# EAGLE design aansluitschema (EAGLE 9.6.2)
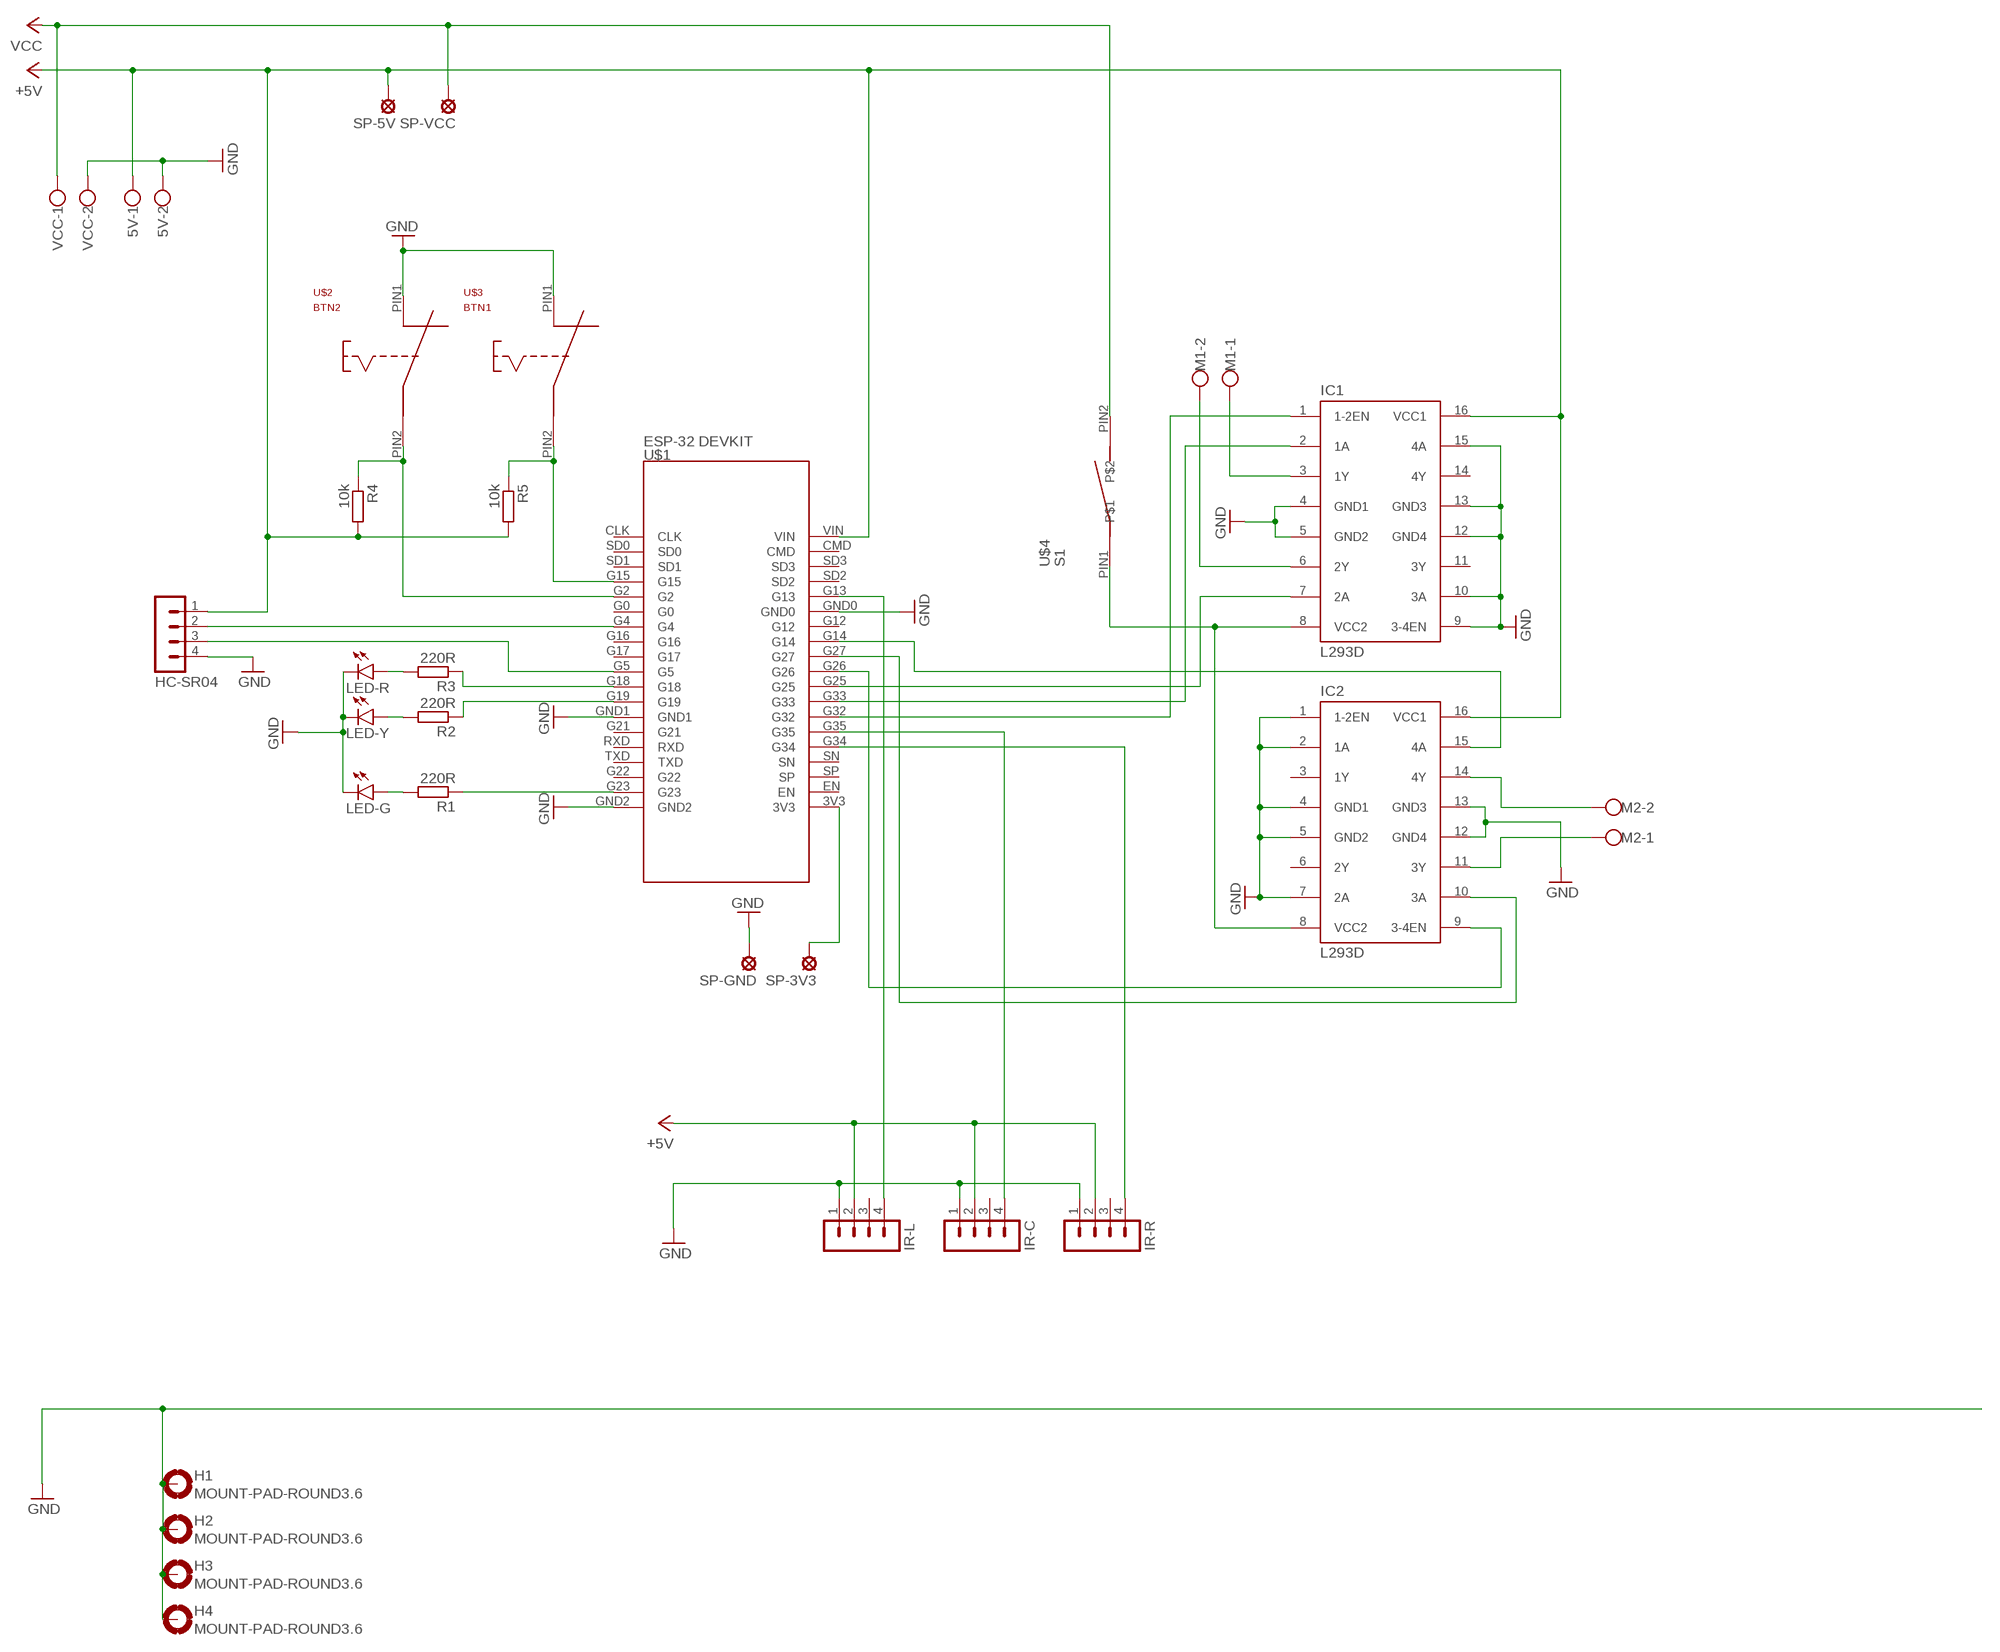
[diagram p0: schematic, sheet 1]

## Parts
5V  W237-102  [W237-102]
H1  MOUNT-PAD-ROUND3.6  [3,6-PAD]
H2  MOUNT-PAD-ROUND3.6  [3,6-PAD]
H3  MOUNT-PAD-ROUND3.6  [3,6-PAD]
H4  MOUNT-PAD-ROUND3.6  [3,6-PAD]
HC-SR04  MA04-1  [MA04-1]
IC1  L293D  L293E  [DIL16]
IC2  L293D  L293E  [DIL16]
IR-C  MA04-1  [MA04-1]
IR-L  MA04-1  [MA04-1]
IR-R  MA04-1  [MA04-1]
LED-G  LED5MM  [LED5MM]
LED-R  LED5MM  [LED5MM]
LED-Y  LED5MM  [LED5MM]
M1  W237-102  [W237-102]
M2  W237-102  [W237-102]
R1  220R  R-EU_0207/10  [0207/10]
R2  220R  R-EU_0207/10  [0207/10]
R3  220R  R-EU_0207/10  [0207/10]
R4  10k  R-EU_0207/10  [0207/10]
R5  10k  R-EU_0207/10  [0207/10]
SP-3V3  LSP10  [LSP10]
SP-5V  LSP10  [LSP10]
SP-GND  LSP10  [LSP10]
SP-VCC  LSP10  [LSP10]
U$1  ESP-32 DEVKIT  ESP-32_DEVKIT  [ESP-32_DEVKIT]
U$2  BTN2  PUSHBUTTON  [PUSHBUTTON]
U$3  BTN1  PUSHBUTTON  [PUSHBUTTON]
U$4  S1  SWITCH  [SWITCH]
VCC  W237-102  [W237-102]

## Nets
+5V: 5V.1 HC-SR04.1 IC1.16(VCC1) IC2.16(VCC1) IR-C.2 IR-L.2 IR-R.2 R4.2 R5.2 SP-5V.MP U$1.VIN
GND: 5V.2 H1.B3,6(MOUNT) H2.B3,6(MOUNT) H3.B3,6(MOUNT) H4.B3,6(MOUNT) HC-SR04.4 IC1.4(GND1) IC1.5(GND2) IC1.9(3-4EN) IC1.10(3A) IC1.12(GND4) IC1.13(GND3) IC1.15(4A) IC2.1(1-2EN) IC2.2(1A) IC2.4(GND1) IC2.5(GND2) IC2.7(2A) IC2.12(GND4) IC2.13(GND3) IR-C.1 IR-L.1 IR-R.1 LED-G.K(C) LED-R.K(C) LED-Y.K(C) SP-GND.MP U$1.GND0 U$1.GND1 U$1.GND2 U$2.PIN1 U$3.PIN1 VCC.2
N$1: IC1.8(VCC2) IC2.8(VCC2) U$4.PIN1
N$2: LED-G.A R1.2
N$3: LED-Y.A R2.2
N$4: LED-R.A R3.2
N$5: R2.1 U$1.G19
N$6: R3.1 U$1.G18
N$7: R1.1 U$1.G23
N$8: IR-R.4 U$1.G34
N$9: IR-C.4 U$1.G35
N$10: IR-L.4 U$1.G13
N$11: HC-SR04.3 U$1.G5
N$12: HC-SR04.2 U$1.G4
N$13: R4.1 U$1.G2 U$2.PIN2
N$14: R5.1 U$1.G15 U$3.PIN2
N$15: IC1.3(1Y) M1.1
N$16: IC1.6(2Y) M1.2
N$17: IC2.11(3Y) M2.1
N$18: IC2.14(4Y) M2.2
N$19: IC1.1(1-2EN) U$1.G32
N$20: IC1.2(1A) U$1.G33
N$21: IC1.7(2A) U$1.G25
N$22: IC2.9(3-4EN) U$1.G26
N$23: IC2.10(3A) U$1.G27
N$24: IC2.15(4A) U$1.G14
N$25: SP-3V3.MP U$1.3V3
VCC: SP-VCC.MP U$4.PIN2 VCC.1
Unconnected: IC1.11(3Y) IC1.14(4Y) IC2.3(1Y) IC2.6(2Y) IR-C.3 IR-L.3 IR-R.3 U$1.CLK U$1.CMD U$1.EN U$1.G0 U$1.G12 U$1.G16 U$1.G17 U$1.G21 U$1.G22 U$1.RXD U$1.SD0 U$1.SD1 U$1.SD2 U$1.SD3 U$1.SN U$1.SP U$1.TXD

## Library data of the parts
5V M1 M2 VCC = con-wago-500:W237-102: WAGO SCREW CLAMP; MPN: 237-102; OC_FARNELL: unknown; OC_NEWARK: 70K9898
H1-H4 = holes:MOUNT-PAD-ROUND: MOUNTING PAD, round
HC-SR04 IR-C IR-L IR-R = con-lstb:MA04-1: PIN HEADER; OC_FARNELL: unknown; OC_NEWARK: unknown
IC1 IC2 = texas:L293E: TI DEVICE; MF: Arrow Electronics; MPN: L293E; OC_FARNELL: 1467711; OC_NEWARK: 89K0732
LED-G LED-R LED-Y = led:LED: LED OSRAM: - CHIPLED LG R971, LG N971, LY N971, LG Q971, LY Q971, LO R971, LY R971 LH N974, LH R974 LS Q976, LO Q976, LY Q976 LO Q996 - Hyper CHIPLED LW Q18S LB Q993, LB Q99A, LB R99A - SideLED LS A670, LO A670, LY A670, LG A670, LP A670 LB A673, LV A673, LT A673, LW A673 LH A674 LY A675 LS A676, LA A676, LO A676, LY A676, LW A676 LS A679, LY A679, LG A679 - Hyper Micro SIDELED® LS Y876, LA Y876, LO Y876, LY Y876 LT Y87S - SmartLED LW L88C, LW L88S LB L89C, LB L89S, LG L890 LS L89K, LO L89K, LY L89K LS L896, LA L896, LO L896, LY L896 - TOPLED LS T670, LO T670, LY T670, LG T670, LP T670 LSG T670, LSP T670, LSY T670, LOP T670, LYG T670 LG T671, LOG T671, LSG T671 LB T673, LV T673, LT T673, LW T673 LH T674 LS T676, LA T676, LO T676, LY T676, LB T676, LH T676, LSB T676, LW T676 LB T67C, LV T67C, LT T67C, LS T67K, LO T67K, LY T67K, LW E67C LS E67B, LA E67B, LO E67B, LY E67B, LB E67C, LV E67C, LT E67C LW T67C LS T679, LY T679, LG T679 LS T770, LO T770, LY T770, LG T770, LP T770 LB T773, LV T773, LT T773, LW T773 LH T774 LS E675, LA E675, LY E675, LS T675 LS T776, LA T776, LO T776, LY T776, LB T776 LHGB T686 LT T68C, LB T68C - Hyper Mini TOPLED® LB M676 - Mini TOPLED Santana® LG M470 LS M47K, LO M47K, LY M47K Source: http://www.osram.convergy.de LUXEON: - LUMILED® LXK2-PW12-R00, LXK2-PW12-S00, LXK2-PW14-U00, LXK2-PW14-V00 LXK2-PM12-R00, LXK2-PM12-S00, LXK2-PM14-U00 LXK2-PE12-Q00, LXK2-PE12-R00, LXK2-PE12-S00, LXK2-PE14-T00, LXK2-PE14-U00 LXK2-PB12-K00, LXK2-PB12-L00, LXK2-PB12-M00, LXK2-PB14-N00, LXK2-PB14-P00, LXK2-PB14-Q00 LXK2-PR12-L00, LXK2-PR12-M00, LXK2-PR14-Q00, LXK2-PR14-R00 LXK2-PD12-Q00, LXK2-PD12-R00, LXK2-PD12-S00 LXK2-PH12-R00, LXK2-PH12-S00 LXK2-PL12-P00, LXK2-PL12-Q00, LXK2-PL12-R00 Source: www.luxeon.com KINGBRIGHT: KA-3528ASYC Source: www.kingbright.com
R1-R5 = rcl:R-EU_: RESISTOR, European symbol; SPICEPREFIX: R
SP-3V3 SP-5V SP-GND SP-VCC = solpad:LSP10: SOLDER PAD drill 1.0 mm, distributor Buerklin, 12H555
U$1 = IoT_project:ESP-32_DEVKIT
U$2 U$3 = IoT_project:PUSHBUTTON
U$4 = IoT_project:SWITCH

## Board
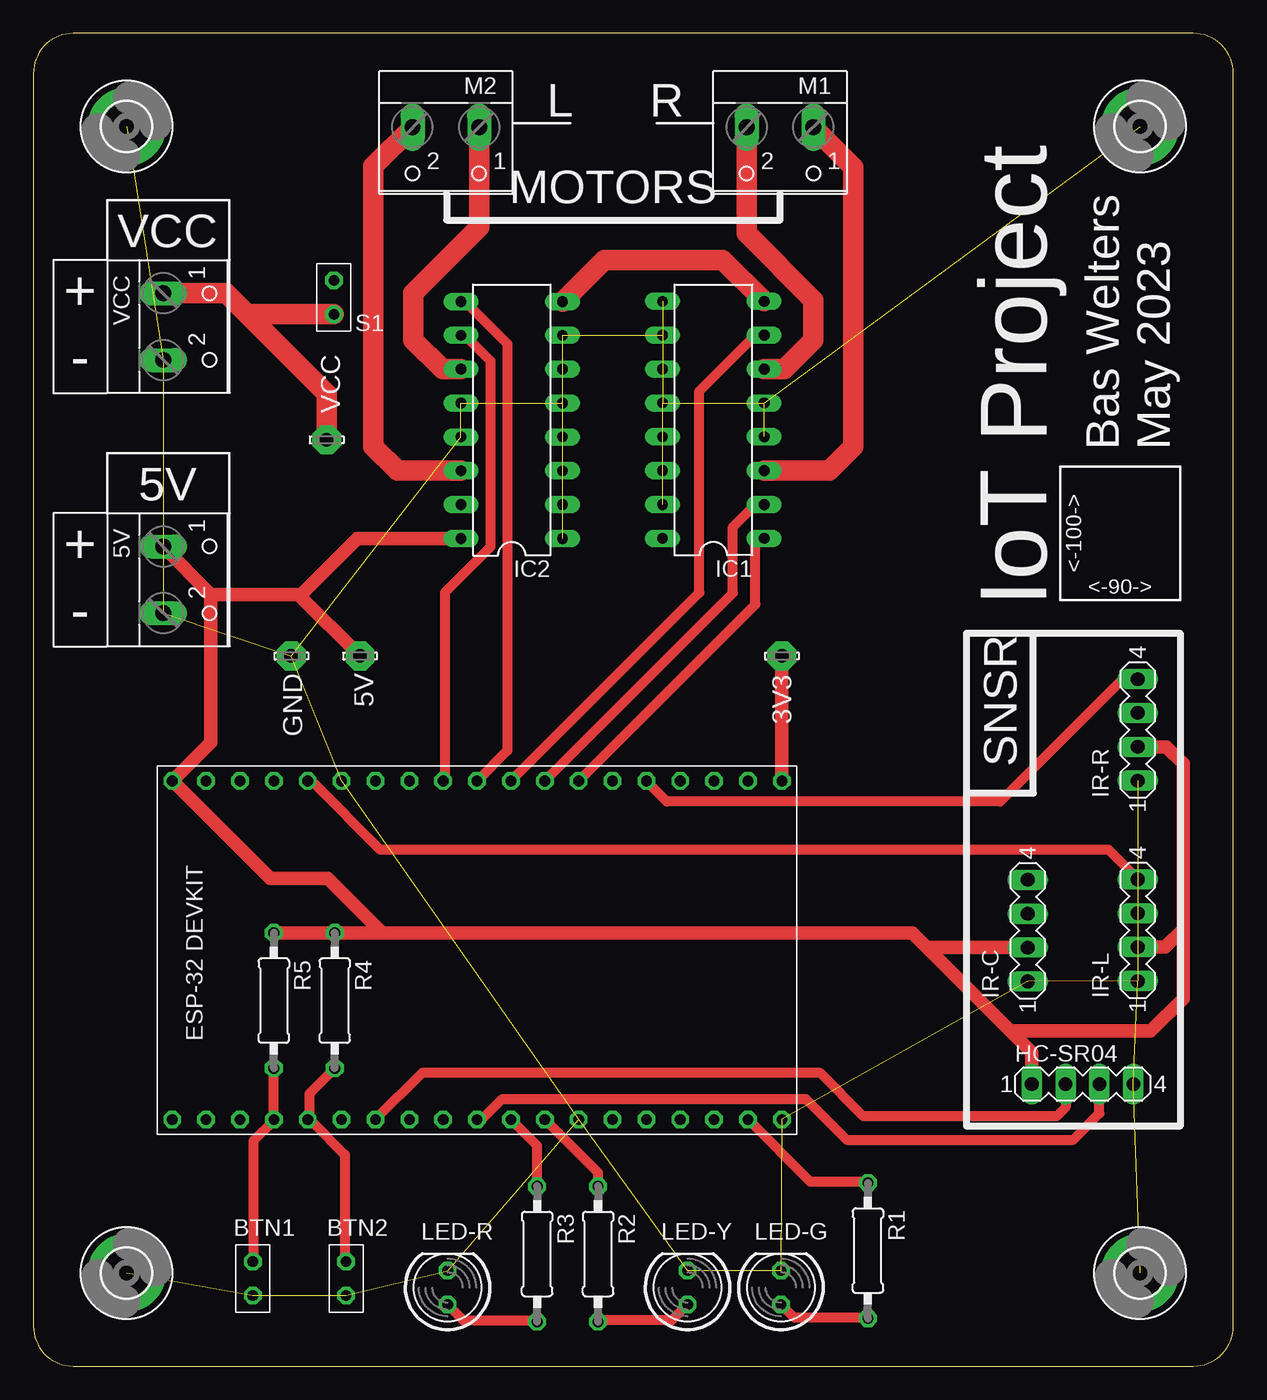
[diagram p1: board, top side]
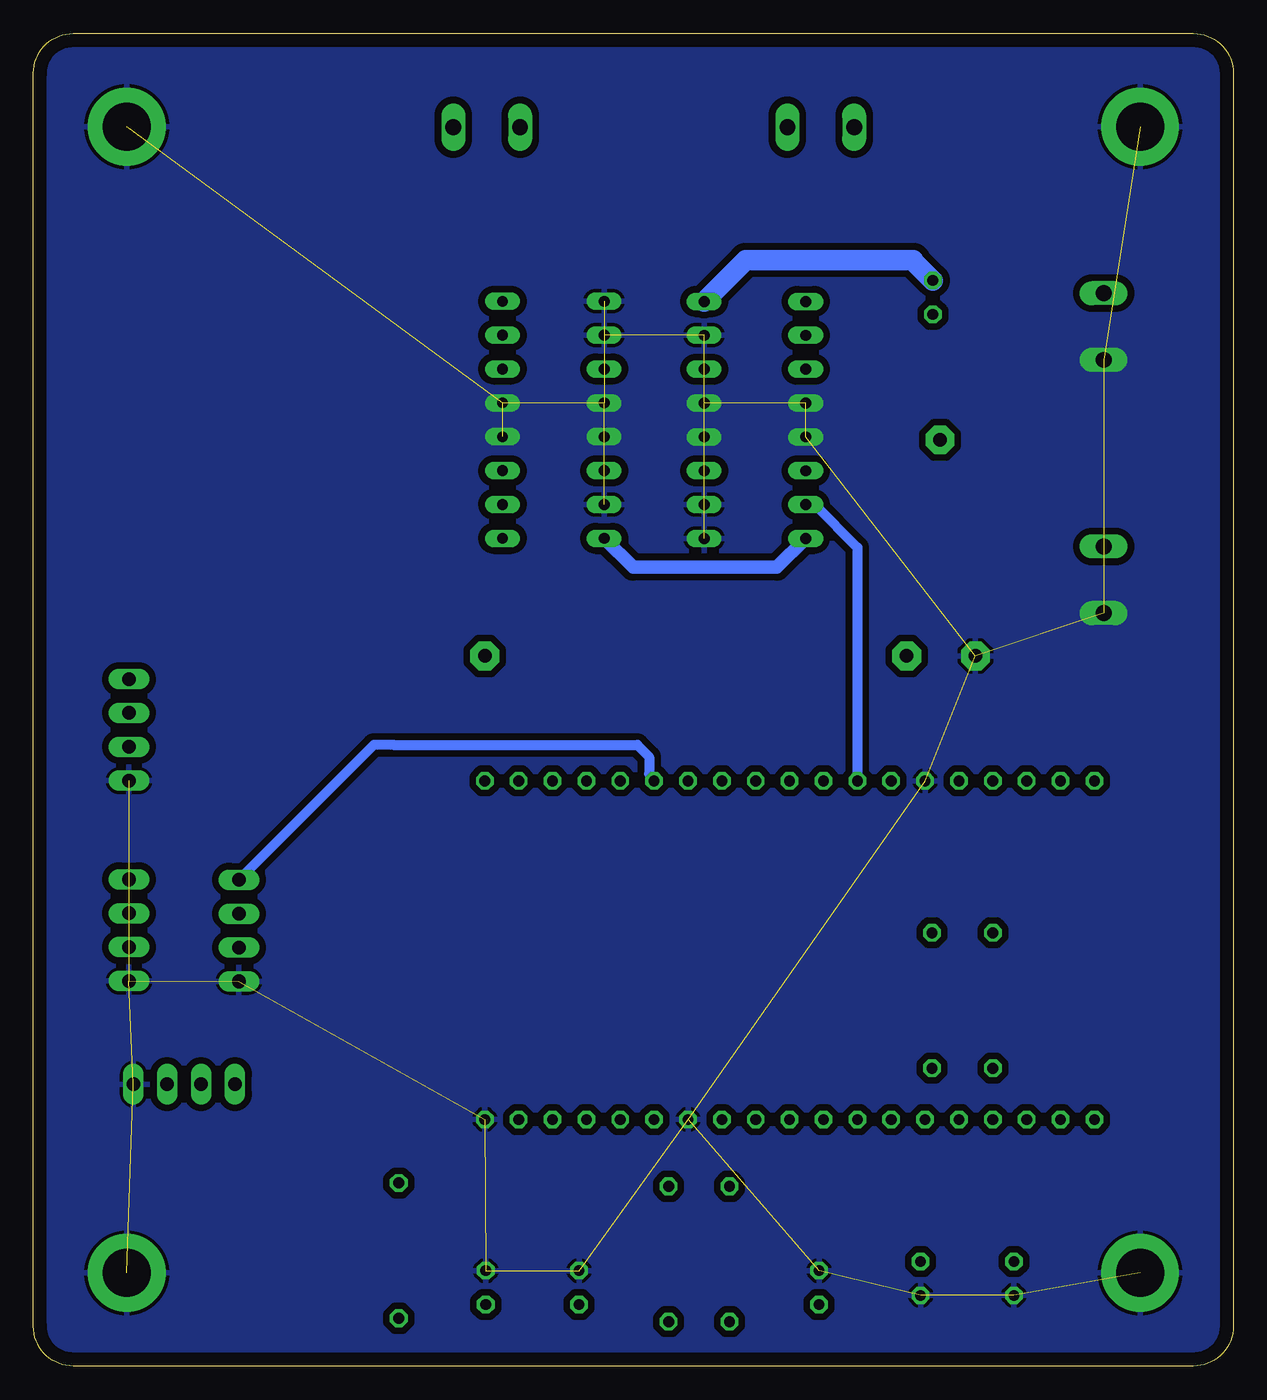
[diagram p2: board, bottom side, seen from below]

Size 90 x 100 mm. Coordinates in mm from the lower left corner, seen from the top.
Outline: 3,0 87,0 arc90 90,3 90,97 arc90 87,100 3,100 arc90 0,97 0,3 arc90 3,0
Copper layers (1*16): Top 0.035mm / dielectric 1.5mm / Bottom 0.035mm
Design rules "default *": minimum track width 30mil, minimum drill 0.6mm, track to track 20mil, track to pad 20mil, pad to pad 20mil, via to via 20mil, smd to smd 20mil, copper to edge 40mil, drill to drill 20mil, minimum pad ring 10mil, minimum via ring 8mil, stop-mask expansion 4mil, vias tented up to drill 0mil, thermal gap 10mil

### Footprints (pad centres in the part's own frame; a part is rotated, then mirrored left to right if it is on the bottom)
W237-102 = drill 1.194 long: 1 -2.5,-1.27; 2 2.5,-1.27
3,6-PAD = drill 3.6 pad 5.842: B3,6 0,0
MA04-1 = drill 1.016 long: 1 -3.81,0; 2 -1.27,0; 3 1.27,0; 4 3.81,0
DIL16 = drill 0.813 long: 1 -8.89,-3.81; 2 -6.35,-3.81; 3 -3.81,-3.81; 4 -1.27,-3.81; 5 1.27,-3.81; 6 3.81,-3.81; 7 6.35,-3.81; 8 8.89,-3.81; 9 8.89,3.81; 10 6.35,3.81; 11 3.81,3.81; 12 1.27,3.81; 13 -1.27,3.81; 14 -3.81,3.81; 15 -6.35,3.81; 16 -8.89,3.81
LED5MM = drill 0.813 octagon: A -1.27,0; K 1.27,0
0207/10 = drill 0.813 octagon: 1 -5.08,0; 2 5.08,0
LSP10 = drill 1.016 pad 2.159 octagon: MP 0,0
ESP-32_DEVKIT = drill 0.8 octagon: 3V3 27.4,2.28; CLK 2,48; CMD 27.4,45.46; EN 27.4,4.82; G0 2,35.3; G2 2,37.84; G4 2,32.76; G5 2,25.14; G12 27.4,32.76; G13 27.4,37.84; G14 27.4,30.22; G15 2,40.38; G16 2,30.22; G17 2,27.68; G18 2,22.6; G19 2,20.06; G21 2,14.98; G22 2,7.36; G23 2,4.82; G25 27.4,22.6; G26 27.4,25.14; G27 27.4,27.68; G32 27.4,17.52; G33 27.4,20.06; G34 27.4,12.44; G35 27.4,14.98; GND0 27.4,35.3; GND1 2,17.52; GND2 2,2.28; RXD 2,12.44; SD0 2,45.46; SD1 2,42.92; SD2 27.4,40.38; SD3 27.4,42.92; SN 27.4,9.9; SP 27.4,7.36; TXD 2,9.9; VIN 27.4,48
PUSHBUTTON = drill 0.8 octagon: PIN1 2.54,2.54; PIN2 5.08,2.54
SWITCH = drill 0.8 octagon: PIN1 2.54,2.54; PIN2 5.08,2.54

### Placement (x,y rotation side)
5V  11,59 270 top
H1  83,93 0 top
H2  83,7 0 top
H3  7,7 0 top
H4  7,93 0 top
HC-SR04  78.69,21.16 0 top
IC1  51,71 90 top
IC2  35.88,70.99 90 top
IR-C  74.58,32.68 90 top
IR-L  82.83,32.71 90 top
IR-R  82.83,47.74 90 top
LED-G  56.07,5.9 90 top
LED-R  31.07,5.9 90 top
LED-Y  49.07,5.9 90 top
M1  56,91.69 180 top
M2  30.94,91.69 180 top
R1  62.59,8.67 270 top
R2  42.35,8.42 270 top
R3  37.78,8.42 270 top
R4  22.61,27.43 90 top
R5  18.03,27.43 90 top
SP-3V3  56.13,53.28 0 top
SP-5V  24.5,53.28 0 top
SP-GND  19.34,53.28 0 top
SP-VCC  22,69.5 0 top
U$1  58.42,16.51 90 top
U$2  26,2.77 90 top
U$3  19,2.77 90 top
U$4  20,84 270 top
VCC  11,78 270 top

### Tracks (layer width: path | path; a pad name or v marks a point on that pad's centre or on a via)
+5V
  Top 1.016: R5.2 R4.2 26.16,32.51 | 26.16,32.51 65.91,32.51 67.02,31.41 | 67.02,31.41 IR-C.2 | IR-L.2 84.91,31.44 86.23,32.77 | IR-R.2 84.97,46.47 86.23,45.21 86.23,32.77 | 26.16,32.51 22.1,36.58 17.78,36.58 10.79,43.56 U$1.VIN 13.32,46.81 13.32,57.91 | 86.23,32.77 86.23,27.56 83.82,25.15 73.28,25.15 | HC-SR04.1 74.88,23.55 73.28,25.15 | 73.28,25.15 67.02,31.41 | 5V.1 13.32,57.91 | SP-5V.MP 19.87,57.91 | 13.32,57.91 19.87,57.91 | 19.87,57.91 20.09,57.91 24.28,62.1 IC2.16
  Bottom 1.016: IC2.16 34.23,59.94 45.02,59.94 IC1.16
GND  (32 unrouted)
  pour Bottom (isolate 0.508, rank 2): 0,0 0,100 90,100 90,0
  pour Bottom (isolate 0.508, no thermals): 30.23,68.58 30.23,73.41 56.8,73.41 56.8,68.58
  pour Bottom (isolate 0.508, no thermals): 7.06,77.22 12.39,77.22 12.39,73.66 7.06,73.66
  pour Bottom (isolate 0.508, no thermals): 6.8,58.17 12.14,58.17 12.14,54.61 6.8,54.61
N$1
  Top 1.524: IC2.8 42.81,83 51.7,83 IC1.8
  Bottom 1.524: U$4.PIN1 24,82.92 24,83 36.57,83 IC2.8
N$2
  Top 0.762: R1.2 62.48,3.68 57.02,3.68 56.13,4.57 LED-G.A
N$3
  Top 0.762: R2.2 42.42,3.43 47.88,3.43 49.02,4.57 LED-Y.A
N$4
  Top 0.762: R3.2 37.72,3.43 32.26,3.43 31.11,4.57 LED-R.A
N$5
  Top 0.762: R2.1 42.35,14.52 U$1.G19
N$6
  Top 0.762: R3.1 37.78,16.55 U$1.G18
N$7
  Top 0.762: R1.1 62.5,13.84 58.27,13.84 U$1.G23
N$8
  Top 0.762: IR-R.4 81.69,51.55 72.5,42.37 47.52,42.37 U$1.G34
N$9
  Bottom 0.762: U$1.G35 43.81,44.45 43.81,45.72 44.7,46.61 62.99,46.61 64.46,46.61 IR-C.4
N$10
  Top 0.762: U$1.G13 20.95,43.81 26.04,38.73 80.64,38.73 82.8,36.58 IR-L.4
N$11
  Top 0.762: U$1.G5 33.64,18.51 35.18,20.05 57.95,20.05 61,17 78,17 79.96,18.96 HC-SR04.3
N$12
  Top 0.762: HC-SR04.2 77.42,19.42 76.75,18.75 62.25,18.75 59,22 29.15,22 U$1.G4
N$13
  Top 0.762: R4.1 20.7,20.45 20.7,18.63 U$1.G2 20.95,18.29 23.37,15.88 23.37,7.87 U$2.PIN2
N$14
  Top 0.762: U$3.PIN2 16.51,7.87 16.51,16.89 18.03,18.41 U$1.G15 R5.1
N$15
  Top 1.524: IC1.3 59.69,67.19 61.5,69 61.5,89.96 M1.1
N$16
  Top 1.524: IC1.6 56.31,74.81 58.5,77 58.5,80 53.5,85 M1.2
N$17
  Top 1.524: IC2.11 30.7,74.8 28.5,77 28.5,80.5 33.44,85.44 M2.1
N$18
  Top 1.524: IC2.14 27.32,67.18 25.5,69 25.5,90.02 M2.2
N$19
  Top 0.762: U$1.G32 54.15,57.16 54.15,62.11 IC1.1
N$20
  Top 0.762: U$1.G33 52.46,58.01 52.46,62.96 54.15,64.65 IC1.2
N$21
  Top 0.762: U$1.G25 49.95,58.04 49.95,73.15 54.15,77.35 IC1.7
N$22
  Top 0.762: IC2.9 32.19,79.76 32.51,79.76 35.55,76.71 35.55,46.18 U$1.G26
N$23
  Top 0.762: IC2.10 32.19,77.22 32.51,77.22 34.28,75.44 34.28,61.46 30.86,58.04 30.86,44.03 U$1.G27
N$24
  Bottom 0.762: IC2.15 31.41,64.64 28.2,61.43 U$1.G14
N$25
  Top 0.762: 56.13,43.94 U$1.3V3
  Top 1.016: SP-3V3.MP 56.13,43.94
VCC
  Top 1.524: VCC.1 14.48,80.5 15.98,79 16.06,78.92 | 16.06,78.92 22,72.98 SP-VCC.MP | U$4.PIN2 16.06,78.92

### Text on the board
tPlace: L | R | MOTORS | VCC | + | - | 5V | + | <-100-> | <-90-> | - | SNSR
tNames: VCC | Bas Welters / May 2023 | IoT Project | GND | 5V | 3V3